# EAGLE board umotion_2_v1.2_pcb_2 (EAGLE 9.5.2)
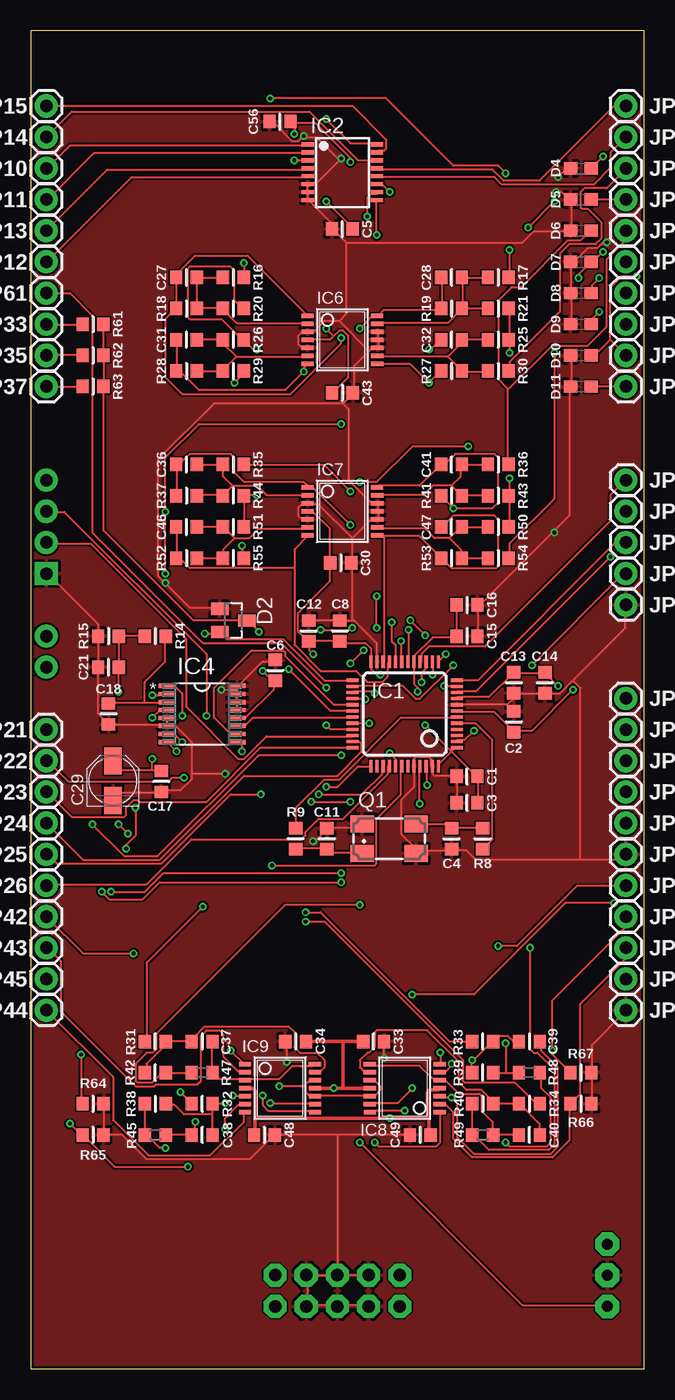
[diagram p5: board, top side]
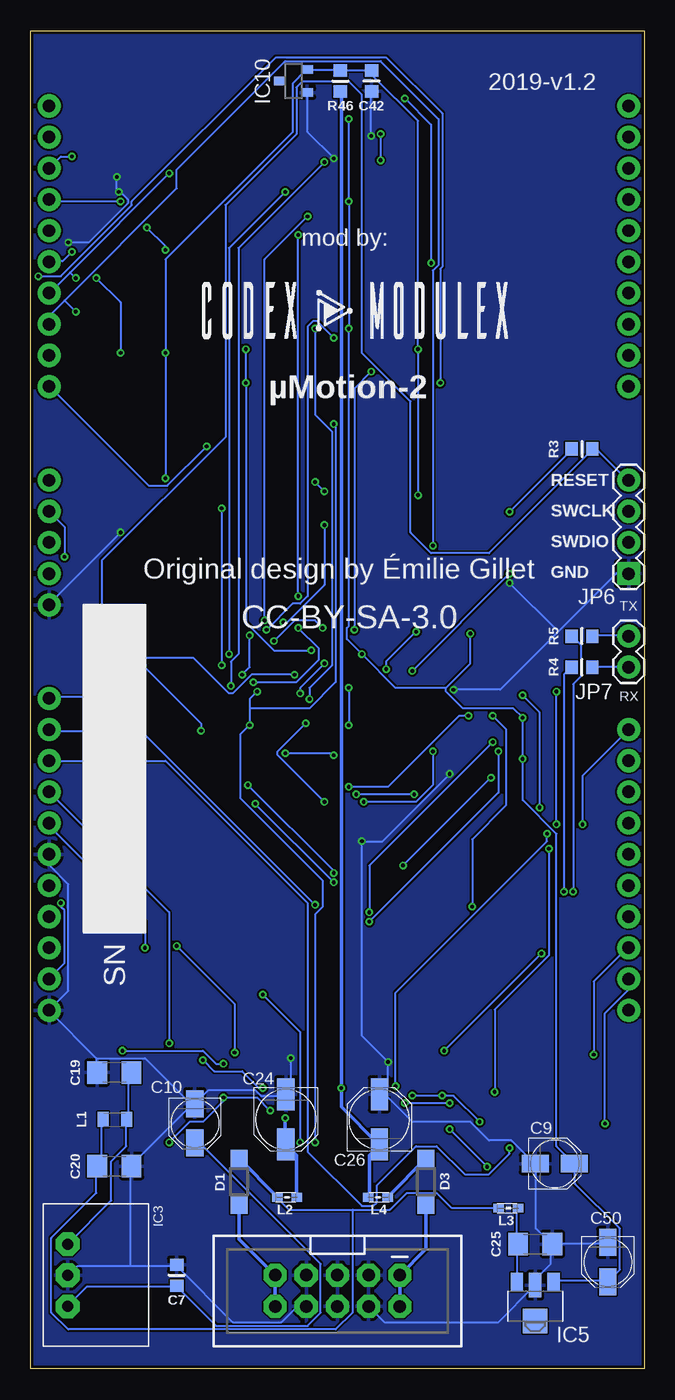
[diagram p6: board, bottom side, seen from below]

Size 50 x 109 mm. Coordinates in mm from the lower left corner, seen from the top.
Outline: 0,0 50,0 50,109 0,109 0,0
Copper layers (1*16): Top 0.035mm / dielectric 1.5mm / Bottom 0.035mm
Design rules "dirt_cheap_dirty_boards.v1.1": minimum track width 6mil, minimum drill 12mil, track to track 6mil, track to pad 6mil, pad to pad 6mil, via to via 6mil, smd to smd 0mil, copper to edge 10mil, drill to drill 10mil, minimum pad ring 10mil, minimum via ring 6mil, stop-mask expansion 2mil, vias tented up to drill 25mil, thermal gap 10mil

## Footprints (pad centres in the part's own frame; a part is rotated, then mirrored left to right if it is on the bottom)
PARTS_AMAN_RESISTOR_0603 = smd 1 x 1.1: 1 -0.85,0; 2 0.85,0
PANASONIC_B = smd 2.2 x 1.4: + 1.6,0; - -1.6,0
C1206 = smd 1.6 x 1.8: 1 -1.4,0; 2 1.4,0
PANASONIC_C = smd 2.6 x 1.4: + 2.05,0; - -2.05,0
SOD123 = smd 1.4 x 1.4: A 1.9,0; C -1.9,0
SOT23 = smd 1 x 1.4: 1 -0.95,-1.1; 2 0.95,-1.1; 3 0,1.1
0603 = smd 1.1 x 1: 1 -0.85,0; 2 0.85,0
LQFP48 = smd 0.254 x 1: 1 -2.75,-4.25; 2 -2.25,-4.25; 3 -1.75,-4.25; 4 -1.25,-4.25; 5 -0.75,-4.25; 6 -0.25,-4.25; 7 0.25,-4.25; 8 0.75,-4.25; 9 1.25,-4.25; 10 1.75,-4.25; 11 2.25,-4.25; 12 2.75,-4.25; 25 2.75,4.25; 26 2.25,4.25; 27 1.75,4.25; 28 1.25,4.25; 29 0.75,4.25; 30 0.25,4.25; 31 -0.25,4.25; 32 -0.75,4.25; 33 -1.25,4.25; 34 -1.75,4.25; 35 -2.25,4.25; 36 -2.75,4.25 | smd 1 x 0.254: 13 4.25,-2.75; 14 4.25,-2.25; 15 4.25,-1.75; 16 4.25,-1.25; 17 4.25,-0.75; 18 4.25,-0.25; 19 4.25,0.25; 20 4.25,0.75; 21 4.25,1.25; 22 4.25,1.75; 23 4.25,2.25; 24 4.25,2.75; 37 -4.25,2.75; 38 -4.25,2.25; 39 -4.25,1.75; 40 -4.25,1.25; 41 -4.25,0.75; 42 -4.25,0.25; 43 -4.25,-0.25; 44 -4.25,-0.75; 45 -4.25,-1.25; 46 -4.25,-1.75; 47 -4.25,-2.25; 48 -4.25,-2.75
TSSOP16_065 = smd 0.35 x 1: 1 -1.95,-2.825; 2 -1.3,-2.825; 3 -0.65,-2.825; 4 0,-2.825; 5 0.65,-2.825; 6 1.3,-2.825; 7 1.95,-2.825; 8 2.6,-2.825; 9 2.6,2.825; 10 1.95,2.825; 11 1.3,2.825; 12 0.65,2.825; 13 0,2.825; 14 -0.65,2.825; 15 -1.3,2.825; 16 -1.95,2.825
WE78 = drill 0.9 pad 1.93 octagon: 1 -2.54,0; 2 0,0; 3 2.54,0
SOP65P640X110-16N = smd 1.422 x 0.356: 1 -2.845,2.286; 2 -2.845,1.626; 3 -2.845,0.965; 4 -2.845,0.33; 5 -2.845,-0.33; 6 -2.845,-0.965; 7 -2.845,-1.626; 8 -2.845,-2.286; 9 2.845,-2.286; 10 2.845,-1.626; 11 2.845,-0.965; 12 2.845,-0.33; 13 2.845,0.33; 14 2.845,0.965; 15 2.845,1.626; 16 2.845,2.286
SOT89 = smd 1 x 1.5: 1 -1.499,-1.981; 3 1.499,-1.981 | smd 1 x 2: 2 0,-1.727 | smd 2 x 2: 2@1 0,1.194
TSSOP14_065 = smd 0.35 x 1: 1 -1.95,-2.845; 2 -1.3,-2.845; 3 -0.65,-2.845; 4 0,-2.845; 5 0.65,-2.845; 6 1.3,-2.845; 7 1.95,-2.845; 8 1.95,2.845; 9 1.3,2.845; 10 0.65,2.845; 11 0,2.845; 12 -0.65,2.845; 13 -1.3,2.845; 14 -1.95,2.825
DBZ_R-PDSO-G3 = smd 0.7 x 1: 1 -0.95,-1.1; 2 0.95,-1.1; 3 0,1.1
PARTS_AMAN_1X01 = drill 1.016 pad 1.88: 1 0,0
2X5-SHROUDED = drill 1.016 pad 1.88 octagon: 1 -1.27,5.08; 2 1.27,5.08; 3 -1.27,2.54; 4 1.27,2.54; 5 -1.27,0; 6 1.27,0; 7 -1.27,-2.54; 8 1.27,-2.54; 9 -1.27,-5.08; 10 1.27,-5.08
1X04 = drill 1.016 pad 1.88 square: 1 0,0 | drill 1.016 pad 1.88: 2 2.54,0; 3 5.08,0; 4 7.62,0
1X02 = drill 1.016 pad 1.88: 1 0,0; 2 2.54,0
L2012C = smd 0.9 x 1.25: 1 -0.9,0; 2 1,0
0603' = smd 0.85 x 0.7: 1 -0.9,0; 2 0.7,0
CTS406 = smd 1.9 x 1.4: 1 -2.2,-1.2; 2 2.2,-1.2; 3 2.2,1.2; 4 -2.2,1.2
R0603 = smd 1 x 1.1: 1 -0.85,0; 2 0.85,0

## Placement (x,y rotation side)
C1  1u  [PARTS_AMAN_RESISTOR_0603]  35.56,48.26 180 top
C2  100n  [PARTS_AMAN_RESISTOR_0603]  39.37,52.7 90 top
C3  100n  [PARTS_AMAN_RESISTOR_0603]  35.56,46.1 180 top
C4  20p  [PARTS_AMAN_RESISTOR_0603]  34.29,43.18 90 top
C5  100n  [PARTS_AMAN_RESISTOR_0603]  25.4,92.84 180 top
C6  100n  [PARTS_AMAN_RESISTOR_0603]  19.94,56.9 90 top
C7  100n  [PARTS_AMAN_RESISTOR_0603]  38.1,7.62 90 bottom
C8  100n  [PARTS_AMAN_RESISTOR_0603]  25.2,60.11 90 top
C9  10u  [PANASONIC_B]  7.29,16.71 0 bottom
C10  10u  [PANASONIC_B]  36.63,19.99 270 bottom
C11  20p  [PARTS_AMAN_RESISTOR_0603]  24.13,43.18 270 top
C12  1u  [PARTS_AMAN_RESISTOR_0603]  22.66,60.11 90 top
C13  1u  [PARTS_AMAN_RESISTOR_0603]  39.37,55.88 270 top
C14  100n  [PARTS_AMAN_RESISTOR_0603]  41.91,55.88 270 top
C15  100n  [PARTS_AMAN_RESISTOR_0603]  35.56,59.69 0 top
C16  1u  [PARTS_AMAN_RESISTOR_0603]  35.56,62.23 0 top
C17  100n  [PARTS_AMAN_RESISTOR_0603]  10.64,47.84 270 top
C18  1u  [PARTS_AMAN_RESISTOR_0603]  6.35,53.34 270 top
C19  22u  [C1206]  43.18,24.13 180 bottom
C20  22u  [C1206]  43.18,16.51 0 bottom
C21  1u  [PARTS_AMAN_RESISTOR_0603]  6.35,57.15 180 top
C24  22u  [PANASONIC_C]  29.21,20.32 270 bottom
C25  22u  [C1206]  8.89,10.16 0 bottom
C26  22u  [PANASONIC_C]  21.59,20.32 90 bottom
C27  100p  [PARTS_AMAN_RESISTOR_0603]  12.7,88.9 180 top
C28  1.0n  [PARTS_AMAN_RESISTOR_0603]  34.29,88.9 180 top
C29  10u  [PANASONIC_B]  6.71,47.9 90 top
C30  100n  [PARTS_AMAN_RESISTOR_0603]  25.27,65.66 0 top
C31  100p  [PARTS_AMAN_RESISTOR_0603]  12.7,83.82 180 top
C32  1.0n  [PARTS_AMAN_RESISTOR_0603]  34.29,83.82 180 top
C33  100n  [PARTS_AMAN_RESISTOR_0603]  27.94,26.67 180 top
C34  100n  [PARTS_AMAN_RESISTOR_0603]  21.59,26.67 0 top
C36  100p  [PARTS_AMAN_RESISTOR_0603]  12.7,73.66 180 top
C37  47p  [PARTS_AMAN_RESISTOR_0603]  13.97,26.67 0 top
C38  47p  [PARTS_AMAN_RESISTOR_0603]  13.97,19.05 180 top
C39  47p  [PARTS_AMAN_RESISTOR_0603]  40.64,26.67 0 top
C40  47p  [PARTS_AMAN_RESISTOR_0603]  40.64,19.05 180 top
C41  1.0n  [PARTS_AMAN_RESISTOR_0603]  34.29,73.66 180 top
C42  1u  [PARTS_AMAN_RESISTOR_0603]  22.23,104.9 270 bottom
C43  100n  [PARTS_AMAN_RESISTOR_0603]  25.4,79.5 0 top
C46  1.0n  [PARTS_AMAN_RESISTOR_0603]  12.7,68.58 180 top
C47  1.0n  [PARTS_AMAN_RESISTOR_0603]  34.29,68.58 180 top
C48  100n  [PARTS_AMAN_RESISTOR_0603]  19.05,19.05 0 top
C49  100n  [PARTS_AMAN_RESISTOR_0603]  31.75,19.05 180 top
C50  10u  [PANASONIC_B]  2.97,8.69 270 bottom
C56  1.0n  [PARTS_AMAN_RESISTOR_0603]  20.32,101.6 180 top
D1  1N5819HW  [SOD123]  33.02,15.24 270 bottom
D2  BAT54S  [SOT23]  16.51,60.96 270 top
D3  1N5819HW  [SOD123]  17.78,15.24 90 bottom
D4  TVS  [0603]  44.83,97.79 0 top
D5  TVS  [0603]  44.83,95.25 0 top
D6  TVS  [0603]  44.83,92.71 0 top
D7  TVS  [0603]  44.83,90.17 0 top
D8  TVS  [0603]  44.83,87.63 0 top
D9  TVS  [0603]  44.83,85.09 0 top
D10  TVS  [0603]  44.83,82.55 0 top
D11  TVS  [0603]  44.83,80.01 0 top
IC1  STM32F373CCT6  [LQFP48]  30.48,53.34 90 top
IC2  4051PW  [TSSOP16_065]  25.4,97.79 270 top
IC3  R-78E3.3-0.5  [WE78]  46.99,7.62 270 bottom
IC4  DAC8164ICPW  [SOP65P640X110-16N]  13.97,53.34 0 top
IC5  LD2981ABU33  [SOT89]  8.89,5.08 180 bottom
IC6  MCP6004  [TSSOP14_065]  25.4,83.82 270 top
IC7  MCP6004  [TSSOP14_065]  25.4,69.85 270 top
IC8  TLV4172  [TSSOP14_065]  30.48,22.86 90 top
IC9  TLV4172  [TSSOP14_065]  20.32,22.86 270 top
IC10  LM4040B10  [DBZ_R-PDSO-G3]  28.57,104.9 90 bottom
JP1  +3V3_A  [PARTS_AMAN_1X01]  48.5,54.61 0 top
JP5  M05X2SHD  [2X5-SHROUDED]  25,6.35 270 bottom
JP6  [1X04]  1.27,64.77 90 bottom
JP7  [1X02]  1.27,57.15 90 bottom
JP8  SLOPE_POT  [PARTS_AMAN_1X01]  48.5,100.33 0 top
JP9  SMOOTHNESS_POT  [PARTS_AMAN_1X01]  48.5,102.87 0 top
JP10  SLOPE_ATT  [PARTS_AMAN_1X01]  1.27,97.79 0 top
JP11  FREQUENCY_ATT  [PARTS_AMAN_1X01]  1.27,95.25 0 top
JP12  SMOOTHNESS_ATT  [PARTS_AMAN_1X01]  1.27,90.17 0 top
JP13  SHAPE_ATT  [PARTS_AMAN_1X01]  1.27,92.71 0 top
JP14  SHIFT_POT  [PARTS_AMAN_1X01]  1.27,100.33 0 top
JP15  SHIFT_ATT  [PARTS_AMAN_1X01]  1.27,102.87 0 top
JP16  FREQUENCY_POT  [PARTS_AMAN_1X01]  48.5,72.39 0 top
JP17  SHAPE_POT  [PARTS_AMAN_1X01]  48.5,69.85 0 top
JP21  LED_1_R  [PARTS_AMAN_1X01]  1.27,52.07 0 top
JP22  LED_1_G  [PARTS_AMAN_1X01]  1.27,49.53 0 top
JP23  LED_3_R  [PARTS_AMAN_1X01]  1.27,46.99 0 top
JP24  LED_3_G  [PARTS_AMAN_1X01]  1.27,44.45 0 top
JP25  LED_2_R  [PARTS_AMAN_1X01]  1.27,41.91 0 top
JP26  LED_2_G  [PARTS_AMAN_1X01]  1.27,39.37 0 top
JP27  J5  [PARTS_AMAN_1X01]  48.5,97.79 0 top
JP28  J4  [PARTS_AMAN_1X01]  48.5,92.71 0 top
JP29  J3  [PARTS_AMAN_1X01]  48.5,90.17 0 top
JP30  J6  [PARTS_AMAN_1X01]  48.5,95.25 0 top
JP31  J1  [PARTS_AMAN_1X01]  48.5,87.63 0 top
JP32  J2_TIP_1  [PARTS_AMAN_1X01]  48.5,85.09 0 top
JP33  J2_TIP_2  [PARTS_AMAN_1X01]  1.27,85.09 0 top
JP34  J7_TIP_1  [PARTS_AMAN_1X01]  48.5,82.55 0 top
JP35  J7_TIP_2  [PARTS_AMAN_1X01]  1.27,82.55 0 top
JP36  J8_TIP_1  [PARTS_AMAN_1X01]  48.5,80.01 0 top
JP37  J8_TIP_2  [PARTS_AMAN_1X01]  1.27,80.01 0 top
JP38  J9  [PARTS_AMAN_1X01]  48.5,52.07 0 top
JP39  J10  [PARTS_AMAN_1X01]  48.5,49.53 0 top
JP40  J11  [PARTS_AMAN_1X01]  48.5,46.99 0 top
JP41  J12  [PARTS_AMAN_1X01]  48.5,44.45 0 top
JP42  LED4_1  [PARTS_AMAN_1X01]  1.27,36.83 0 top
JP43  LED4_2  [PARTS_AMAN_1X01]  1.27,34.29 0 top
JP44  LED5_1  [PARTS_AMAN_1X01]  1.27,29.21 0 top
JP45  LED5_2  [PARTS_AMAN_1X01]  1.27,31.75 0 top
JP46  LED6_1  [PARTS_AMAN_1X01]  48.5,31.75 0 top
JP47  LED6_2  [PARTS_AMAN_1X01]  48.5,34.29 0 top
JP48  LED7_1  [PARTS_AMAN_1X01]  48.5,39.37 0 top
JP49  LED7_2  [PARTS_AMAN_1X01]  48.5,36.83 0 top
JP50  GND  [PARTS_AMAN_1X01]  48.5,29.21 0 top
JP51  GND  [PARTS_AMAN_1X01]  48.5,41.91 0 top
JP52  GND  [PARTS_AMAN_1X01]  48.5,62.23 0 top
JP60  SW_2_SW_RANGE  [PARTS_AMAN_1X01]  48.5,67.31 0 top
JP61  SW_3_SW_MODE  [PARTS_AMAN_1X01]  1.27,87.63 0 top
JP62  SW_1_SW_SHIFT  [PARTS_AMAN_1X01]  48.5,64.77 0 top
L1  33u  [L2012C]  43.18,20.32 0 bottom
L2  [0603']  29.21,13.97 180 bottom
L3  [0603']  11.18,13.08 180 bottom
L4  [0603']  21.59,13.97 0 bottom
Q1  8MHz  [CTS406]  29.21,43.18 0 top
R3  10k  [PARTS_AMAN_RESISTOR_0603]  5.08,74.93 0 bottom
R4  100  [PARTS_AMAN_RESISTOR_0603]  5.08,57.15 180 bottom
R5  100  [PARTS_AMAN_RESISTOR_0603]  5.08,59.69 180 bottom
R8  100  [PARTS_AMAN_RESISTOR_0603]  36.83,43.18 90 top
R9  100  [PARTS_AMAN_RESISTOR_0603]  21.59,43.18 270 top
R14  130k  [PARTS_AMAN_RESISTOR_0603]  10.16,59.69 0 top
R15  100k  [PARTS_AMAN_RESISTOR_0603]  6.35,59.69 0 top
R16  100k  [PARTS_AMAN_RESISTOR_0603]  16.51,88.9 0 top
R17  100k  [PARTS_AMAN_RESISTOR_0603]  38.1,88.9 0 top
R18  20k  [PARTS_AMAN_RESISTOR_0603]  12.7,86.36 0 top
R19  20k  [PARTS_AMAN_RESISTOR_0603]  34.29,86.36 0 top
R20  120k  [PARTS_AMAN_RESISTOR_0603]  16.51,86.36 0 top
R21  120k  [PARTS_AMAN_RESISTOR_0603]  38.1,86.36 0 top
R25  120k  [PARTS_AMAN_RESISTOR_0603]  38.1,83.82 0 top
R26  390k  [PARTS_AMAN_RESISTOR_0603]  16.51,83.82 0 top
R27  20k  [PARTS_AMAN_RESISTOR_0603]  34.29,81.28 0 top
R28  130k  [PARTS_AMAN_RESISTOR_0603]  12.7,81.28 0 top
R29  100k  [PARTS_AMAN_RESISTOR_0603]  16.51,81.28 0 top
R30  100k  [PARTS_AMAN_RESISTOR_0603]  38.1,81.28 0 top
R31  20k  [PARTS_AMAN_RESISTOR_0603]  10.16,26.67 180 top
R32  20k  [PARTS_AMAN_RESISTOR_0603]  13.97,21.59 180 top
R33  20k  [PARTS_AMAN_RESISTOR_0603]  36.83,26.67 180 top
R34  20k  [PARTS_AMAN_RESISTOR_0603]  40.64,21.59 0 top
R35  100k  [PARTS_AMAN_RESISTOR_0603]  16.51,73.66 0 top
R36  100k  [PARTS_AMAN_RESISTOR_0603]  38.1,73.66 0 top
R37  130k  [PARTS_AMAN_RESISTOR_0603]  12.7,71.12 0 top
R38  130k  [PARTS_AMAN_RESISTOR_0603]  10.16,21.59 0 top
R39  130k  [PARTS_AMAN_RESISTOR_0603]  36.83,24.13 180 top
R40  130k  [PARTS_AMAN_RESISTOR_0603]  36.83,21.59 0 top
R41  20k  [PARTS_AMAN_RESISTOR_0603]  34.29,71.12 0 top
R42  130k  [PARTS_AMAN_RESISTOR_0603]  10.16,24.13 180 top
R43  120k  [PARTS_AMAN_RESISTOR_0603]  38.1,71.12 0 top
R44  390k  [PARTS_AMAN_RESISTOR_0603]  16.51,71.12 0 top
R45  1.0k  [R0603]  10.16,19.05 0 top
R46  1.5k  [PARTS_AMAN_RESISTOR_0603]  24.77,104.9 90 bottom
R47  1.0k  [R0603]  13.97,24.13 0 top
R48  1.0k  [R0603]  40.64,24.13 0 top
R49  1.0k  [R0603]  36.83,19.05 0 top
R50  140k  [PARTS_AMAN_RESISTOR_0603]  38.1,68.58 0 top
R51  120k  [PARTS_AMAN_RESISTOR_0603]  16.51,68.58 0 top
R52  20k  [PARTS_AMAN_RESISTOR_0603]  12.7,66.04 0 top
R53  33k  [PARTS_AMAN_RESISTOR_0603]  34.29,66.04 0 top
R54  100k  [PARTS_AMAN_RESISTOR_0603]  38.1,66.04 0 top
R55  100k  [PARTS_AMAN_RESISTOR_0603]  16.51,66.04 0 top
R61  10k  [PARTS_AMAN_RESISTOR_0603]  5.08,85.09 0 top
R62  10k  [PARTS_AMAN_RESISTOR_0603]  5.08,82.55 0 top
R63  10k  [PARTS_AMAN_RESISTOR_0603]  5.08,80.01 0 top
R64  1.0k  [PARTS_AMAN_RESISTOR_0603]  5.08,21.59 0 top
R65  1.0k  [PARTS_AMAN_RESISTOR_0603]  5.08,19.05 0 top
R66  1.0k  [PARTS_AMAN_RESISTOR_0603]  44.83,21.59 0 top
R67  1.0k  [PARTS_AMAN_RESISTOR_0603]  44.83,24.13 0 top

## Tracks (layer width: path | path; a pad name or v marks a point on that pad's centre or on a via)
+3V3  (via drill 0.3)
  Top 0.152: C3.1 36.42,46.18 36.42,48.16 C1.1 36.27,48.31 34.29,50.29 | 34.29,50.29 34.59,50.6 IC1.1 | 34.29,50.29 33.22,49.23 IC1.48 | C16.1 34.75,62.18 34.75,59.74 C15.1 34.59,59.59 32.77,59.59 31.24,58.06 31.24,57.61 IC1.17 31.24,57.45 31.24,55.78 31.55,55.47 v31.55,55.17 | v32.16,52.43 34.29,50.29 | 19.81,55.93 19.81,55.32 17.53,53.03 16.92,53.03 IC4.12 | v10.97,64.77 v10.97,69.8 10.97,74.22 13.72,76.96 v25.3,76.96 | 19.81,55.93 v18.9,56.84 | 19.81,55.93 C6.1 | v26.82,18.44 40.08,5.18 46.94,5.18 IC3.3
  Bottom 0.152: 38.1,6.71 45.41,6.71 46.94,5.18 IC3.3 | 38.1,6.71 34.9,3.5 27.43,3.5 26.36,4.57 26.36,8.53 36.12,18.29 36.58,18.29 C10.+ | 38.1,6.71 C7.1 | 32.16,53.8 32.16,54.56 v31.55,55.17 | 32.16,53.8 v32.16,52.43 32.92,51.66 32.92,46.48 26.21,39.78 26.21,37.64 26.82,37.03 v26.82,18.44 | v10.97,69.8 5.94,74.83 R3.1 | v18.9,56.84 v10.97,64.77 | 32.16,53.8 27.28,53.8 25.15,55.93 25.15,76.81 v25.3,76.96
+3V3_A  (via drill 0.3)
  Top 0.152: IC6.4 24.38,83.82 24.69,84.12 | 24.69,84.12 25.15,84.58 25.45,84.58 25.91,84.12 25.91,80.77 24.69,79.55 C43.1 | v24.08,101.8 26.06,99.82 28.19,99.82 IC2.16 | v24.08,95.1 26.21,92.96 C5.1 | v24.08,84.73 24.69,84.12 | IC1.9 34.75,54.71 37.34,54.71 39.32,56.69 C13.1 39.47,56.69 41.91,56.69 | 41.91,56.69 v42.98,55.63 | 41.91,56.69 C14.1 | IC7.4 22.55,69.8 23.01,69.8 24.38,68.43 24.38,65.68 C30.1 24.38,65.53 24.38,64.16 21.79,61.57 21.79,60.05 22.55,59.28 C12.1 | C12.1 22.71,59.28 25.15,59.28 C8.1 25.3,59.13 27.28,59.13 27.74,58.67 27.74,57.61 IC1.24 27.74,57.45 27.74,57 28.19,56.54 v28.5,56.54 | IC1.25 26.21,56.08 23.93,56.08 20.57,59.44 16,59.44 15.54,59.89 D2.2 15.39,59.89 v14.17,59.89 | 9.91,48.77 7.32,48.77 6.71,49.38 C29.+ | 9.91,48.77 10.52,48.77 C17.1 | v9.91,53.03 10.52,53.65 11.12,53.65 IC4.4 | 9.91,48.77 v9.91,49.68 | v23.01,58.22 22.71,58.52 22.71,59.13 C12.1
  Bottom 0.152: v24.08,101.8 v24.08,95.1 v24.08,84.73 24.08,60.5 24.23,60.35 24.23,59.44 v23.01,58.22 20.27,55.47 16.15,55.47 | JP1.1 48.46,54.71 43.89,54.71 v42.98,55.63 42.98,55.93 41,57.91 36.73,57.91 33.83,55.02 33.53,55.02 32,56.54 v28.5,56.54 | IC5.1 7.32,7.16 3.05,7.16 C50.+ 2.9,7.16 1.98,8.08 1.98,11.43 5.64,15.09 5.64,16.61 C9.+ 5.79,16.76 7.16,18.14 7.16,43.59 9.91,46.33 v9.91,49.68 v9.91,53.03 10.67,53.8 14.78,53.8 16.15,55.17 16.15,55.47 | v14.17,59.89 14.17,57.45 16.15,55.47
ADC_CLOCK  (via drill 0.3)
  Top 0.152: R37.1 11.89,71.17 11.89,73.61 C36.2 11.89,73.76 12.19,73.76 12.95,74.52 16.31,74.52 16.61,74.22 16.61,73 17.37,72.24 22.25,72.24 22.55,71.93 IC7.1 22.55,71.78 23.01,71.78 v26.06,68.73 | v29.41,60.81 29.41,59.28 29.72,58.98 29.72,57.61 IC1.20
  Bottom 0.152: v29.41,60.81 29.11,60.81 26.06,63.86 v26.06,68.73
ADC_FM
  Top 0.152: C46.2 11.89,68.58 11.89,66.14 R52.1 11.89,65.99 12.19,65.99 12.95,65.23 21.49,65.23 | 21.49,65.23 21.49,66.75 22.55,67.82 IC7.7 | 21.49,65.23 21.49,58.98 23.62,56.84 26.52,56.84 27.43,55.93 28.65,55.93 29.11,56.39 29.11,57.45 IC1.21
ADC_SHAPE  (via drill 0.3)
  Top 0.152: v28.04,55.02 27.89,55.17 26.36,55.17 IC1.27 | v27.13,58.52 v26.06,57.45 | R27.1 33.38,81.23 v32.46,80.31 30.94,81.84 28.35,81.84 IC6.8 | v32.46,83.06 32.61,83.06 33.38,83.82 C32.2
  Bottom 0.152: v28.04,55.02 28.04,55.47 v26.06,57.45 | v27.13,58.52 30.18,58.52 32.46,60.81 v32.46,80.31 v32.46,83.06
ADC_SHIFT  (via drill 0.3)
  Top 0.152: C28.2 33.53,88.85 33.53,86.41 R19.1 33.38,86.26 28.8,86.26 28.35,85.8 IC6.14 28.19,85.65 27.74,85.65 v26.82,84.73 | v27.28,54.56 26.36,54.56 IC1.28
  Bottom 0.152: v27.28,54.56 27.28,55.47 25.45,57.3 25.45,76.35 26.82,77.72 v26.82,84.73
ADC_SLOPE  (via drill 0.3)
  Top 0.152: IC6.1 22.55,85.8 17.68,90.68 13.41,90.68 11.73,89 C27.2 11.89,88.85 11.89,86.41 R18.1 11.73,86.26 10.97,85.5 10.97,80.77 12.34,79.4 21.18,79.4 25.3,83.52 v25.3,83.97 | v30.79,60.2 30.79,57.61 IC1.18
  Bottom 0.152: v30.79,60.2 28.65,62.33 28.04,62.33 27.43,62.94 27.43,84.89 26.98,85.34 26.67,85.34 v25.3,83.97
ADC_SMOOTHNESS  (via drill 0.3)
  Top 0.152: IC7.14 28.35,71.93 31.7,71.93 33.38,73.61 C41.2 33.53,73.76 33.83,73.76 34.59,74.52 37.8,74.52 38.1,74.22 38.1,70.56 37.64,70.1 v34.44,70.1 33.53,71.02 R41.1 | v34.44,57.3 31.7,54.56 31.39,54.56 30.33,55.63 26.36,55.63 IC1.26
  Bottom 0.152: v34.44,70.1 v34.44,57.3
ADC_TRIG  (via drill 0.3)
  Top 0.152: C31.2 11.89,83.82 11.89,81.38 R28.1 11.89,81.23 12.19,81.23 13.72,79.7 20.73,79.7 v22.25,81.23 22.25,81.53 22.55,81.84 IC6.7 | v30.18,59.28 30.18,57.61 IC1.19 | v26.21,60.35 26.06,60.35 25.91,60.2 v23.62,60.2
  Bottom 0.152: v30.18,59.28 28.5,60.96 26.82,60.96 v26.21,60.35 | v23.62,60.2 23.62,79.86 v22.25,81.23
ADC_V_OCT
  Top 0.152: 28.8,67.82 31.7,67.82 33.38,66.14 R53.1 33.53,65.99 34.29,65.23 37.95,65.23 38.1,65.38 38.1,69.19 37.8,69.49 34.44,69.49 33.53,68.58 C47.2 | 28.8,67.82 28.35,67.82 IC7.8 | 28.8,67.82 28.8,57.61 IC1.22
AREF_-10  (via drill 0.3)
  Top 0.152: R50.2 39.01,68.58 39.01,71.02 R43.2 39.01,71.17 v39.01,72.54 | 39.01,83.82 39.01,86.26 R21.2 | 39.01,83.82 v39.01,82.75 | 39.01,83.82 R25.2 | R51.2 17.37,68.58 17.37,71.02 R44.2 17.37,71.17 v18.44,71.17 | R20.2 17.22,86.41 16.61,87.02 16.61,89.46 16.31,89.76 12.95,89.76 12.8,89.61 12.8,85.65 12.95,85.5 15.54,85.5 17.22,83.82 R26.2 17.37,83.82 18.14,83.06 v18.44,83.06
  Bottom 0.152: v39.01,72.54 v39.01,82.75 39.01,90.37 28.65,100.74 28.65,104.7 27.58,105.77 IC10.2 27.43,105.77 24.84,105.77 R46.2 24.69,105.77 22.25,105.77 C42.1 22.1,105.61 22.1,105.31 18.44,101.65 v18.44,83.06 v18.44,71.17
CLOCK_IN  (via drill 0.3)
  Top 0.152: v26.06,71.48 23.93,73.61 17.37,73.61 R35.2 | v26.82,72.24 28.19,72.24 31.09,75.13 v35.66,75.13 | JP36.1 D11.2
  Bottom 0.152: v26.82,72.24 v26.06,71.48 | v35.66,75.13 38.86,71.93 40.39,71.93 48.46,80.01 JP36.1
DAC_1  (via drill 0.3)
  Top 0.152: v14.02,37.64 9.45,33.07 9.45,26.67 R31.2 | v12.34,53.19 12.34,55.02 11.73,55.63 IC4.1
  Bottom 0.152: v14.02,37.64 14.02,43.13 11.28,45.87 11.28,52.12 v12.34,53.19
DAC_2  (via drill 0.3)
  Top 0.152: v12.19,22.55 13.11,21.64 R32.2 | v7.77,42.37 7.77,42.67 8.53,43.43 v8.53,45.72 | v9.91,54.86 11.12,54.86 IC4.2
  Bottom 0.152: v12.19,22.55 12.19,29.26 7.77,33.68 v7.77,42.37 | v8.53,45.72 8.53,53.49 v9.91,54.86
DAC_3  (via drill 0.3)
  Top 0.152: R33.2 34.14,26.67 23.62,37.19 v22.4,37.19 | v12.34,51.05 11.73,51.66 11.12,51.66 IC4.7
  Bottom 0.152: v22.4,37.19 22.4,41 v12.34,51.05
DAC_4  (via drill 0.3)
  Top 0.152: v22.4,36.42 23.93,36.42 35.2,25.15 35.2,23.47 35.36,23.32 39.47,23.32 41.15,21.64 41.45,21.64 R34.2 | IC4.8 v11.89,50.29
  Bottom 0.152: v22.4,36.42 11.89,46.94 v11.89,50.29
DAC_MOSI
  Top 0.152: IC1.31 26.21,53.03 18.14,53.03 17.53,52.43 16.92,52.43 IC4.11
DAC_SCK
  Top 0.152: IC1.29 26.21,54.1 24.69,54.1 20.73,58.06 20.73,58.37 20.57,58.52 17.98,58.52 14.94,55.47 14.94,53.03 16.15,51.82 16.76,51.82 IC4.10
DAC_SS  (via drill 0.3)
  Top 0.152: v27.58,52.58 26.36,52.58 IC1.32 | v22.86,46.18 v26.06,46.18 | v17.22,50.29 17.22,50.75 16.92,51.05 IC4.9
  Bottom 0.152: v27.58,52.58 29.87,50.29 29.87,49.99 v26.06,46.18 | v22.86,46.18 18.59,46.18 17.22,47.55 v17.22,50.29
FM_IN  (via drill 0.3)
  Top 0.152: v17.22,67.06 17.22,66.14 R55.2 | v46.33,86.11 45.72,85.5 45.72,85.19 D9.2
  Bottom 0.152: v17.22,67.06 17.22,89.46 16.76,89.92 16.76,101.8 21.49,106.53 29.26,106.53 38.1,97.69 38.1,96.16 47.24,87.02 | 47.24,87.02 48.46,85.8 48.46,85.19 JP32.1 | 47.24,87.02 v46.33,86.11
FREQUENCY_ATT
  Top 0.152: IC2.2 22.55,99.06 5.18,99.06 1.37,95.25 JP11.1
FREQUENCY_POT
  Top 0.152: IC1.16 31.85,57.61 31.85,58.22 32.46,58.83 37.03,58.83 47.24,69.04 47.24,71.17 48.46,72.39 JP16.1
GND  (via drill 0.3)
  Top 0.152: 44.04,87.63 44.04,85.19 D9.1 | 44.04,87.63 44.04,90.07 D7.1 44.04,90.22 44.35,90.22 45.41,91.29 46.18,91.29 46.63,91.75 v46.94,91.75 | 44.04,87.63 D8.1 | v42.98,97.08 43.59,97.69 43.89,97.69 D4.1 | v42.82,95.86 43.28,95.86 43.89,95.25 D5.1 44.04,95.25 44.04,92.81 D6.1 43.89,92.66 41,92.66 40.08,91.75 25.76,91.75 | 25.15,98.45 23.32,96.62 22.71,96.62 IC2.6 22.55,96.47 22.55,95.86 IC2.7 22.55,95.71 22.55,95.25 IC2.8 22.71,95.1 24.54,93.27 24.54,92.96 C5.2 24.69,92.81 25.76,91.75 | 22.25,100.28 23.32,100.28 25.15,98.45 | 22.25,100.28 22.1,100.28 21.79,99.97 21.34,99.97 19.81,101.5 19.51,101.5 C56.2 | 25.15,98.45 v25.3,98.6 | 22.25,100.28 v22.25,100.43 | C29.- 6.71,46.33 7.32,46.94 10.52,46.94 C17.2 10.67,47.09 12.19,47.09 13.11,48.01 13.11,48.46 | 5.49,57.15 5.49,59.59 R15.1 5.49,59.74 5.49,60.66 1.37,64.77 JP6.1 | 11.12,52.43 6.4,52.43 C18.2 6.25,52.58 5.49,53.34 5.49,57.15 | 11.12,52.43 IC4.5 | 11.12,52.43 IC4.6 11.12,52.27 11.89,52.27 13.11,51.05 13.11,48.46 | 5.49,57.15 C21.2 | IC4.13 16.76,53.8 16.76,54.25 IC4.14 16.76,54.41 16.76,54.86 IC4.15 16.76,55.02 16.76,55.32 | C6.2 19.81,57.61 18.9,57.61 16.92,55.63 IC4.16 16.76,55.63 16.76,55.32 | v15.54,55.32 16.76,55.32 | 22.55,70.41 22.1,70.41 21.79,70.1 21.79,69.49 21.95,69.34 22.55,69.34 IC7.5 | 26.21,60.96 C8.2 C12.2 | 26.21,60.96 26.36,60.96 28.19,59.13 28.19,57.61 IC1.23 | 26.21,60.96 26.21,65.53 C30.2 26.21,65.68 26.21,67.67 | 26.21,67.67 27.74,69.19 28.19,69.19 IC7.10 28.35,69.34 28.35,69.8 IC7.11 28.35,69.95 28.35,70.41 IC7.12 28.19,70.56 27.74,70.56 25.91,72.39 25.91,78.18 25.45,78.64 | 22.55,70.41 23.47,70.41 26.21,67.67
  Top 0.152: 22.55,70.41 IC7.3 | IC6.5 22.55,83.21 22.1,83.21 21.79,83.52 21.79,84.12 22.1,84.43 22.55,84.43 IC6.3 22.55,84.58 23.16,84.58 23.93,85.34 25.15,85.34 | 28.35,83.82 28.35,83.21 IC6.10 28.19,83.06 27.74,83.06 27.58,82.91 | 28.35,83.82 28.35,84.43 IC6.12 | 28.35,83.82 IC6.11 | 27.58,82.91 26.36,81.69 26.36,79.55 C43.2 26.21,79.4 25.45,78.64 | 25.45,78.64 14.94,78.64 10.36,74.07 10.36,64.62 v10.97,64.01 12.95,62.03 15.39,62.03 D2.1 | 27.58,82.91 25.15,85.34 | 25.76,91.75 25.76,85.95 25.15,85.34 | Q1.4 26.98,44.35 26.67,44.04 24.23,44.04 C11.1 24.08,43.89 23.16,42.98 v23.01,42.98 | v20.88,24.99 20.88,26.67 C34.1 | JP5.7 JP5.5 | 22.55,7.62 22.55,5.18 | JP5.8 27.43,5.18 25.15,5.18 JP5.6 24.99,5.18 22.55,5.18 | 22.55,5.18 JP5.4 | 22.55,7.62 JP5.5 | 22.55,7.62 JP5.3 | 5.94,19.05 5.94,21.49 R64.2 | C49.2 24.99,19.05 | 24.99,19.05 C48.2 19.81,19.05 17.83,17.07 9.45,17.07 7.47,19.05 5.94,19.05 | 5.94,19.05 R65.2 | 24.99,19.05 JP5.5 | v28.8,25.3 28.8,26.67 C33.1 | C15.2 36.42,59.74 36.42,62.18 C16.2 36.42,62.33 36.73,62.33 42.52,68.12 | D10.1 44.04,82.45 44.04,80.01 D11.1 43.89,80.01 43.89,69.49 42.52,68.12 | 38.86,54.1 34.75,54.1 IC1.8 | 38.86,54.1 39.32,53.65 C2.2 | 38.86,54.1 39.32,54.56 39.32,55.02 C13.2 39.47,55.02 41.91,55.02 | 44.2,56.08 43.13,55.02 41.91,55.02 | 44.2,56.08 48.46,60.35 48.46,62.18 JP52.1 | 41.91,55.02 C14.2 | 34.29,42.22 31.7,42.22 31.55,42.06 Q1.2 31.39,42.06 31.39,42.37 30.18,43.59 30.18,46.33 31.24,47.4 31.24,49.07 IC1.44 31.24,49.23 31.24,49.68 31.39,49.84 32.46,49.84 32.61,49.68 32.61,49.23 IC1.47 32.77,49.07 32.77,48.46 32.92,48.31 34.59,48.31 C1.2 34.75,48.16 34.75,46.18 C3.2
  Top 0.152: R66.2 45.72,21.64 45.72,24.08 R67.2 45.72,24.23 45.72,26.36 48.46,29.11 JP50.1 | 34.29,42.22 35.51,42.22 36.27,41.45 44.81,41.45 | 44.81,41.45 48.01,41.45 48.46,41.91 JP51.1 | 34.29,42.22 C4.1 | 44.2,56.08 44.81,55.47 44.81,41.45 | v42.67,68.12 42.52,68.12 | v15.85,48.46 13.11,48.46
  Bottom 0.152: v42.98,97.08 42.98,96.01 v42.82,95.86 42.67,95.86 42.06,95.25 42.06,94.94 45.26,91.75 v46.94,91.75 | v25.3,98.6 27.43,100.74 27.43,103.94 IC10.1 | v22.25,100.43 22.25,103.94 C42.2 | v15.54,55.32 11.73,55.32 7.01,60.05 | 7.01,60.05 2.29,64.77 JP6.1 | v10.97,64.01 7.01,60.05 | 21.34,22.55 21.49,22.4 C26.+ 21.34,22.55 | 21.34,22.55 20.88,23.01 v20.88,24.99 23.01,27.13 v23.01,42.98 21.34,42.98 v15.85,48.46 | C25.2 7.62,10.06 7.62,8.53 8.84,7.32 8.84,6.86 IC5.2 8.99,6.71 11.89,3.81 21.18,3.81 22.4,5.03 JP5.4 | C50.- 3.05,10.21 7.47,10.21 C25.2 | C25.2 7.62,10.21 8.84,11.43 8.84,16.61 C9.- 8.99,16.76 10.82,18.59 12.65,18.59 14.17,20.12 18.9,20.12 21.34,22.55 | 41.91,8.38 46.18,8.38 46.94,7.62 IC3.2 | 41.91,8.38 38.1,8.38 | v28.8,25.3 28.8,22.71 29.11,22.4 C24.- 29.26,22.25 31.24,22.25 31.7,22.71 35.51,22.71 C10.- | 36.88,21.49 36.73,21.64 C10.- | 36.88,21.49 41.76,16.61 C20.2 41.91,16.46 41.91,8.38 | 44.65,25.3 44.65,24.23 C19.2 | 44.65,25.3 48.46,29.11 JP50.1 48.46,29.26 46.94,30.79 46.94,39.47 48.46,41 48.46,41.91 JP51.1 | v42.67,68.12 48.46,62.33 JP52.1 | 36.88,21.49 40.69,25.3 44.65,25.3 | 36.88,21.49 C10.- | 38.1,8.38 33.53,3.81 29.57,3.81 28.35,5.03 27.58,5.03 JP5.8 | 38.1,8.38 C7.2
  pour Top (isolate 0.012): 0,108.97 50.04,108.97 50.04,0 0,0
  pour Bottom (isolate 0.012): 0,108.97 50.04,108.97 50.04,0 0,0
LED_MODE_G
  Top 0.152: JP24.1 4.27,41.45 10.52,41.45 17.37,48.31 24.99,48.31 26.98,50.29 26.98,50.9 26.82,51.05 26.36,51.05 IC1.35
LED_MODE_R
  Top 0.152: IC1.36 26.21,50.6 18.75,50.6 14.33,46.18 8.84,46.18 8.69,46.33 8.38,46.33 7.77,45.72 7.77,45.11 7.62,44.96 3.35,44.96 1.37,46.94 JP23.1
LED_RANGE_G  (via drill 0.3)
  Top 0.152: v19.66,41 28.04,41 28.19,41.15 28.19,44.81 30.18,46.79 30.18,49.07 IC1.42 | v12.5,48.16 11.58,48.16 11.28,47.85 3.05,47.85 1.37,49.53 JP22.1
  Bottom 0.152: v12.5,48.16 v19.66,41
LED_RANGE_R  (via drill 0.3)
  Top 0.152: v29.26,50.14 29.72,49.68 29.72,49.23 IC1.41 | v25.3,49.99 18.59,49.99 10.36,41.76 7.62,41.76 v5.03,44.35
  Bottom 0.152: v29.26,50.14 25.45,50.14 v25.3,49.99 | v5.03,44.35 5.03,48.31 JP21.1
LED_SHIFT_G
  Top 0.152: IC1.40 29.11,49.07 29.11,48.46 25.45,44.81 23.47,44.81 22.4,43.74 22.4,43.43 22.1,43.13 13.11,43.13 9.45,39.47 1.37,39.47 JP26.1
LED_SHIFT_R  (via drill 0.3)
  Top 0.152: v23.47,46.79 26.98,46.79 28.65,48.46 28.65,49.07 IC1.39 | v18.75,46.79 16.31,46.79 10.67,41.15 2.13,41.15 1.37,41.91 JP25.1
  Bottom 0.152: v18.75,46.79 v23.47,46.79
MUX_ADDR_0  (via drill 0.3)
  Top 0.152: v33.83,58.22 33.22,57.61 IC1.13 | v29.26,95.86 28.65,96.47 28.35,96.47 IC2.11
  Bottom 0.152: v33.83,58.22 33.83,91.29 v29.26,95.86
MUX_ADDR_1  (via drill 0.3)
  Top 0.152: v27.43,93.88 27.43,95.4 27.74,95.71 28.19,95.71 IC2.10 | v32.16,59.74 v30.94,60.96 | v32.77,56.54 32.77,57.45 IC1.14
  Bottom 0.152: v27.43,93.88 30.94,90.37 v30.94,60.96 | v32.16,59.74 32.16,57.15 v32.77,56.54
MUX_ADDR_2  (via drill 0.3)
  Top 0.152: v28.19,92.35 28.19,95.1 IC2.9 | v28.19,60.35 v28.19,62.94 | v31.85,55.93 31.85,56.69 32.16,57 32.16,57.45 IC1.15
  Bottom 0.152: v28.19,62.94 v28.19,92.35 | v28.19,60.35 26.52,58.67 26.52,57.76 28.35,55.93 v31.85,55.93
MUXED_POTS  (via drill 0.3)
  Top 0.152: v33.68,55.63 34.59,55.63 IC1.11 | v26.06,98.3 26.06,98.6 23.16,101.5 21.49,101.5 | 21.49,101.5 21.18,101.5 C56.1 21.49,101.5 | v21.49,98.45 22.55,98.45 IC2.3 | 21.49,101.5 v21.49,100.58
  Bottom 0.152: v33.68,55.63 33.68,57.61 33.07,58.22 33.07,91.29 v26.06,98.3 | v21.49,100.58 v21.49,98.45
N$1
  Bottom 0.152: C19.1 41.91,24.08 42.06,23.93 42.06,20.42 L1.2 42.22,20.27 42.22,18.14 43.43,16.92 43.43,13.72 IC3.1
N$2
  Top 0.152: R62.1 4.12,82.6 1.37,82.6 JP35.1
N$3
  Top 0.152: JP37.1 R63.1
N$4
  Top 0.152: 13.56,88.85 15.54,88.85 R16.1 | IC6.2 22.55,85.19 16.76,85.19 15.7,86.26 R20.1 15.54,86.41 13.56,86.41 | 13.56,86.41 13.56,88.85 | 13.56,88.85 C27.1 | 13.56,86.41 R18.2
N$7
  Top 0.152: IC1.5 34.75,52.58 36.27,52.58 37.64,51.21 37.64,43.13 36.88,42.37 R8.1
N$8
  Top 0.152: IC1.6 34.59,53.03 30.18,53.03 25.15,48.01 23.93,48.01 21.64,45.72 21.64,44.04 R9.1
N$26
  Top 0.152: R61.1 4.12,85.04 1.37,85.04 JP33.1
N$28
  Top 0.152: 35.2,88.85 37.19,88.85 R17.1 | IC6.13 28.35,85.19 33.98,85.19 35.05,86.26 R19.2 35.2,86.41 | 35.2,86.41 37.19,86.41 R21.1 | 35.2,86.41 35.2,88.85 | 35.2,88.85 C28.1
N$29
  Top 0.152: 34.29,44.04 36.73,44.04 R8.2 | 34.29,44.04 33.98,44.35 31.55,44.35 Q1.3 | 34.29,44.04 C4.2
N$30
  Top 0.152: R54.1 37.19,65.99 35.2,65.99 R53.2 35.05,66.14 35.05,66.75 34.14,67.67 | 34.14,67.67 32.92,67.67 32.16,68.43 28.35,68.43 IC7.9 | 34.14,67.67 35.05,68.58 C47.1 R50.1
N$32
  Top 0.152: R52.2 13.56,65.99 15.54,65.99 R55.1 15.7,66.14 15.7,66.75 16.61,67.67 | 16.61,67.67 17.83,67.67 18.59,68.43 22.55,68.43 IC7.6 | 16.61,67.67 15.7,68.58 R51.1 C46.1
N$33
  Bottom 0.152: R5.1 4.12,59.74 1.37,59.74 JP7.2
N$34
  Top 0.152: C31.1 R26.1 15.7,83.82 15.7,83.52 16.76,82.45 | 16.76,82.45 22.55,82.45 IC6.6 | 16.76,82.45 15.7,81.38 R29.1 15.54,81.23 13.56,81.23 R28.2
N$35
  Top 0.152: R9.2 21.64,42.37 24.08,42.37 C11.2 24.23,42.22 24.38,42.06 26.98,42.06 Q1.1
N$37
  Top 0.152: R25.1 C32.1 35.05,83.82 35.05,83.52 33.98,82.45 | 33.98,82.45 28.35,82.45 IC6.9 | 33.98,82.45 35.05,81.38 R27.2 35.2,81.23 37.19,81.23 R30.1
N$38
  Bottom 0.3: D3.A 20.89,14.03 L4.2
N$39
  Top 0.152: C36.1 13.56,73.61 15.54,73.61 R35.1 15.7,73.61 15.7,72.69 16.46,71.93 | 16.46,71.93 18.44,71.93 19.2,71.17 22.55,71.17 IC7.2 | 16.46,71.93 15.7,71.17 R44.1 15.54,71.17 13.56,71.17 R37.2
N$40
  Bottom 0.152: L1.1 44.2,20.27 44.2,16.92 44.5,16.61 C20.1 44.65,16.46 44.65,14.33 48.31,10.67 48.31,4.57 46.94,3.2 25.15,3.2 23.77,4.57 23.77,12.95 | 23.77,12.95 28.96,12.95 29.87,13.87 L2.2 | 23.77,12.95 20.73,12.95 19.36,14.33 16.92,14.33 15.7,13.11 11.89,13.11 L3.2
  Bottom 0.3: D1.C 29.91,14.03 L2.2
N$41
  Top 0.152: R36.1 37.19,73.61 35.2,73.61 C41.1 35.05,73.61 35.05,72.69 34.29,71.93 | 34.29,71.93 32.77,71.93 32,71.17 28.35,71.17 IC7.13 | 34.29,71.93 35.05,71.17 R41.2 35.2,71.17 37.19,71.17 R43.1
N$42
  Bottom 0.152: L3.1 10.36,12.95 10.36,10.21 C25.1 10.36,10.06 10.36,7.16 IC5.3
N$45
  Top 0.152: IC9.14 23.01,24.69 21.34,24.69 20.27,23.62 17.53,23.62 IC9.3 17.37,23.62 15.39,23.62 14.94,24.08 R47.2 14.78,24.23 14.78,26.67 C37.2
N$49  (via drill 0.3)
  Top 0.152: 38.71,24.08 39.78,24.08 R48.1 | 38.71,24.08 37.8,24.08 R39.1 | v38.71,26.52 38.71,24.08
  Bottom 0.152: v38.71,26.52 38.71,37.19 48.46,46.94 JP40.1
N$51
  Bottom 0.152: JP7.1 R4.1
N$53  (via drill 0.3)
  Top 0.152: R47.1 13.11,24.08 11.12,24.08 R42.1 10.97,24.08 10.67,24.08 9.91,23.32 8.69,23.32 8.53,23.47 8.53,24.84 9.45,25.76 9.91,25.76 10.21,26.06 10.21,27.28 20.73,37.8 v26.82,37.8
  Bottom 0.152: v26.82,37.8 41,51.97 48.46,51.97 JP38.1
N$54  (via drill 0.3)
  Top 0.152: v31.09,22.86 29.87,21.64 27.74,21.64 IC8.13 | 35.97,24.99 35.97,24.23 R39.2 | 35.97,24.99 37.64,26.67 R33.1 37.8,26.67 38.25,27.13 38.86,27.13 39.32,26.67 C39.1 | 35.97,24.99 v35.97,25.15
  Bottom 0.152: v31.09,22.86 31.39,22.86 32.77,24.23 35.05,24.23 v35.97,25.15
N$56
  Bottom 0.3: JP5.10 JP5.9 33.02,10.56 D1.A
N$58  (via drill 0.3)
  Top 0.152: R40.1 35.97,21.49 35.97,19.05 R49.1 36.12,19.05 37.34,17.83 42.22,17.83 42.67,18.29 42.67,24.38 41.3,25.76 41,25.76 40.69,26.06 v40.69,34.29
  Bottom 0.152: v40.69,34.29 40.69,36.42 48.62,44.35 JP41.1
N$59
  Top 0.152: 37.8,21.64 36.73,22.71 35.51,22.71 34.9,23.32 34.9,24.99 32.31,27.58 28.19,27.58 28.04,27.43 28.04,26.21 27.58,25.76 27.43,25.76 26.82,25.15 26.82,24.54 27.13,24.23 27.58,24.23 IC8.9 | 37.8,21.64 39.78,21.64 R34.1 39.93,21.49 41.45,19.96 41.45,19.05 C40.1 | 37.8,21.64 R40.2
N$60  (via drill 0.3)
  Top 0.152: v19.51,21.64 23.16,21.64 IC9.9 | v15.85,21.64 14.94,21.64 R32.1 14.78,21.49 14.78,20.73 | 14.78,20.73 14.78,19.05 C38.1 | 14.78,20.73 12.5,20.73 11.73,21.49 11.12,21.49 R38.2
  Bottom 0.152: v15.85,21.64 v19.51,21.64
N$61
  Top 0.152: R42.2 9.45,24.23 9.45,24.84 10.97,26.36 10.97,26.67 R31.1 C37.1 13.26,26.67 13.26,26.98 14.17,27.89 21.03,27.89 21.49,27.43 21.49,26.21 21.95,25.76 23.32,25.76 23.93,25.15 23.93,24.54 23.62,24.23 23.16,24.23 IC9.13
N$63  (via drill 0.3)
  Top 0.152: R38.1 9.3,21.49 9.3,19.05 R45.1 9.45,19.05 10.52,17.98 v10.97,17.98
  Bottom 0.152: v10.97,17.98 10.97,17.53 12.65,15.85 14.63,15.85 16.92,18.14 18.59,18.14 21.79,14.94 21.79,13.56 22.1,13.26 23.01,13.26 27.43,17.68 27.43,37.95 39.01,49.53 JP39.1
N$64
  Bottom 0.3: JP5.2 JP5.1 17.78,9.76 D3.C
N$67  (via drill 0.3)
  Top 0.152: IC9.2 17.37,24.23 16.92,24.23 15.7,25.45 15.7,27.28 15.39,27.58 14.33,27.58 13.87,27.13 13.87,23.47 13.56,23.16 10.21,23.16 10.06,23.01 8.53,23.01 2.44,29.11 2.44,33.22 1.37,34.29 JP43.1 | v4.12,25.6 4.12,21.64 R64.1
  Bottom 0.152: v4.12,25.6 4.12,31.55 1.37,34.29 JP43.1
N$68  (via drill 0.3)
  Top 0.152: v16.31,25.91 17.37,24.84 IC9.1 | v8.38,33.83 4.27,33.83 JP42.1
  Bottom 0.152: v8.38,33.83 v16.31,25.91
N$70  (via drill 0.3)
  Top 0.152: v16.46,22.25 17.37,22.25 IC9.5 | v13.41,20.12 13.41,19.2 13.26,19.05 C38.2 R45.2 | v18.9,22.25 18.9,21.49 19.36,21.03 23.16,21.03 IC9.8
  Bottom 0.152: v13.41,20.12 15.54,22.25 v16.46,22.25 v18.9,22.25
N$71  (via drill 0.3)
  Top 0.152: v15.85,19.51 15.85,20.42 16.92,21.49 17.37,21.49 IC9.6 | v12.8,16.46 6.86,16.46 4.27,19.05 R65.1 4.12,19.05 v3.2,19.96
  Bottom 0.152: v12.8,16.46 v15.85,19.51 | v3.2,19.96 3.2,28.96 1.37,30.79 1.37,31.7 JP45.1
N$72
  Top 0.152: JP44.1 6.71,23.77 6.71,20.27 9.6,17.37 14.63,17.37 17.37,20.12 17.37,20.88 IC9.7
N$73  (via drill 0.3)
  Top 0.152: v30.48,21.03 27.74,21.03 IC8.14 | IC8.3 33.38,22.1 v34.29,22.1 34.75,21.64 34.75,18.9 36.12,17.53 42.37,17.53 42.98,18.14 42.98,24.54 41.6,25.91 41.6,26.67 C39.2 | v38.71,18.44 39.01,18.14 42.06,18.14 42.37,18.44 42.37,22.1 41.6,22.86 41.6,24.08 R48.2
  Bottom 0.152: v30.48,21.03 31.55,22.1 33.98,22.1 | v34.29,22.1 33.98,22.1 | v38.71,18.44 37.03,20.12 35.97,20.12 33.98,22.1
N$74
  Top 0.152: IC8.2 33.38,21.49 33.83,21.49 34.44,20.88 34.44,18.75 35.97,17.22 42.52,17.22 43.89,18.59 43.89,21.49 R66.1 44.04,21.64 44.81,22.4 44.81,29.72 48.46,33.38 48.46,34.29 JP47.1
N$75  (via drill 0.3)
  Top 0.152: v28.04,18.44 28.35,18.14 33.07,18.14 33.38,18.44 33.38,20.88 IC8.1 | v31.09,30.48 36.12,30.48 43.59,37.95 v47.55,37.95
  Bottom 0.152: v28.04,18.44 28.04,27.43 v31.09,30.48 | v47.55,37.95 47.55,37.64 47.24,37.34 47.24,33.07 48.46,31.85 JP46.1
N$76
  Top 0.152: C40.2 R49.2 37.64,19.05 37.64,20.12 36.73,21.03 36.73,22.25 36.58,22.4 34.9,22.4 33.83,23.47 33.38,23.47 IC8.5 33.22,23.62 32.77,23.62 31.7,24.69 27.74,24.69 IC8.8
N$77  (via drill 0.3)
  Top 0.152: v34.29,24.84 34.29,24.69 33.83,24.23 33.38,24.23 IC8.6 | R67.1 43.89,24.23 42.52,25.6 v42.52,25.91 42.52,30.02 48.46,35.97 48.46,36.73 JP49.1
  Bottom 0.152: v34.29,24.84 34.9,24.84 35.97,25.91 v42.52,25.91
N$78  (via drill 0.3)
  Top 0.152: v33.38,25.76 33.38,24.84 IC8.7 | v38.1,34.44 39.62,34.44 44.5,39.32 48.46,39.32 JP48.1
  Bottom 0.152: v33.38,25.76 33.38,29.72 v38.1,34.44
NORMALIZATION_PROBE  (via drill 0.3)
  Top 0.152: 5.94,80.01 5.94,82.45 R62.2 5.94,82.6 5.94,85.04 R61.2 | v21.03,57 24.38,53.65 26.21,53.65 IC1.30 | v18.59,60.05 17.68,60.96 D2.3 13.26,60.96 5.94,68.28 5.94,80.01 | 5.94,80.01 R63.2
  Bottom 0.152: v21.03,57 21.03,57.61 v18.59,60.05
RESET  (via drill 0.3)
  Top 0.152: IC1.7 34.75,53.49 37.8,53.49 39.32,51.97 C2.1 39.47,51.97 40.84,51.97 v44.2,55.32
  Bottom 0.152: JP6.4 1.37,72.39 3.81,74.83 4.12,74.83 R3.2 4.27,74.83 12.65,66.45 17.37,66.45 19.05,68.12 19.05,78.79 23.01,82.75 23.01,103.78 24.08,104.85 27.89,104.85 28.35,104.39 28.35,100.58 34.14,94.79 34.14,75.89 44.2,65.84 v44.2,55.32
RX  (via drill 0.3)
  Top 0.152: v32.31,47.55 32.31,49.07 IC1.46 | v25.3,40.39 10.82,40.39 9.3,38.86 v6.55,38.86
  Bottom 0.152: v32.31,47.55 25.3,40.54 v25.3,40.39 | v6.55,38.86 6.55,56.54 5.94,57.15 R4.2
SHAPE_ATT
  Top 0.152: JP13.1 6.25,97.69 22.55,97.69 IC2.4
SHAPE_IN  (via drill 0.3)
  Top 0.152: R30.2 39.01,81.38 39.01,81.99 43.13,86.11 43.13,90.83 43.89,91.59 46.02,91.59 46.48,92.05 46.48,93.42 45.41,94.49 44.96,94.49 44.81,94.64 44.81,95.86 45.11,96.16 46.94,96.16 48.46,97.69 JP27.1 | v46.63,98.75 45.72,97.84 D4.2
  Bottom 0.152: v46.63,98.75 47.55,98.75 48.46,97.84 JP27.1
SHAPE_POT  (via drill 0.3)
  Top 0.152: v47.24,66.14 36.27,55.17 34.75,55.17 IC1.10
  Bottom 0.152: v47.24,66.14 47.24,68.58 48.46,69.8 JP17.1
SHIFT_ATT
  Top 0.152: JP15.1 26.21,102.87 28.96,100.13 28.96,99.36 28.8,99.21 28.35,99.21 IC2.15
SHIFT_IN  (via drill 0.3)
  Top 0.152: v39.01,91.14 39.01,89 R17.2 | v42.67,95.1 v40.54,92.96 | JP30.1 D5.2
  Bottom 0.152: v39.01,91.14 39.01,91.44 v40.54,92.96 | v42.67,95.1 48.31,95.1 48.46,95.25 JP30.1
SHIFT_POT
  Top 0.152: JP14.1 3.35,102.41 22.71,102.41 26.67,98.45 28.19,98.45 IC2.14
SLOPE_ATT
  Top 0.152: IC2.1 22.55,99.67 3.2,99.67 1.37,97.84 JP10.1
SLOPE_IN  (via drill 0.3)
  Top 0.152: v17.37,90.07 17.37,89 R16.2 | v19.51,103.48 28.96,103.48 34.44,97.99 38.1,97.99 v38.71,97.38 | v46.33,88.85 45.72,88.24 45.72,87.63 D8.2
  Bottom 0.152: v17.37,90.07 17.37,101.35 v19.51,103.48 | 46.79,89.31 48.46,87.63 JP31.1 | 46.79,89.31 v38.71,97.38 | 46.79,89.31 v46.33,88.85
SLOPE_POT
  Top 0.152: IC2.12 28.35,97.08 37.8,97.08 38.41,96.47 45.87,96.47 47.24,97.84 47.24,99.06 48.46,100.28 JP8.1
SMOOTHNESS_ATT
  Top 0.152: IC2.5 22.55,97.08 8.23,97.08 1.37,90.22 JP12.1
SMOOTHNESS_IN
  Top 0.152: 38.86,79.7 38.86,79.86 38.1,80.62 38.1,87.02 39.17,88.09 39.93,88.09 43.74,91.9 44.81,91.9 45.57,92.66 D6.2 | 38.86,79.7 38.86,73.76 R36.2 | 38.86,79.7 42.52,83.36 45.41,83.36 46.94,84.89 46.94,90.37 48.46,91.9 48.46,92.66 JP28.1
SMOOTHNESS_POT
  Top 0.152: JP9.1 47.55,102.87 41.45,96.77 38.56,96.77 37.64,97.69 28.35,97.69 IC2.13
SW_MODE  (via drill 0.3)
  Top 0.152: v24.08,52.43 24.38,52.12 26.21,52.12 IC1.33 | v24.08,55.47 20.42,59.13 14.02,59.13 5.03,68.12 5.03,85.8 3.2,87.63 JP61.1
  Bottom 0.152: v24.08,55.47 v24.08,52.43
SW_RANGE
  Top 0.152: IC1.12 34.75,56.08 36.42,56.08 47.55,67.21 48.46,67.21 JP60.1
SW_SHIFT  (via drill 0.3)
  Top 0.152: v36.12,51.97 35.36,51.21 34.75,51.21 IC1.2 | v40.84,57.3 48.31,64.77 JP62.1
  Bottom 0.152: v36.12,51.97 36.12,52.58 v40.84,57.3
SWCLK  (via drill 0.3)
  Top 0.152: v24.08,47.4 24.99,47.4 26.67,49.07 27.74,49.07 IC1.37 | v14.33,53.19 14.33,58.22 2.74,69.8 1.37,69.8 JP6.3
  Bottom 0.152: v24.08,47.4 20.88,47.4 15.09,53.19 v14.33,53.19
SWDIO
  Top 0.152: IC1.34 26.21,51.51 19.2,51.51 17.37,49.68 16.92,49.68 12.65,53.95 12.65,59.44 4.88,67.21 1.37,67.21 JP6.2
TRIG_IN  (via drill 0.3)
  Top 0.152: v16.61,80.31 17.22,80.92 17.22,81.23 R29.2 | v49.38,89 48.16,89 47.24,88.09 47.24,83.82 | 47.24,83.82 48.46,82.6 JP34.1 | 47.24,83.82 46.02,82.6 45.72,82.6 D10.2
  Bottom 0.152: v16.61,80.31 16.61,89.61 16.46,89.76 16.46,102.26 21.03,106.83 30.02,106.83 41.76,95.1 41.76,94.79 47.55,89 v49.38,89
TX  (via drill 0.3)
  Top 0.152: v31.7,46.02 31.7,49.07 IC1.45 | v25.3,39.62 10.52,39.62 9.14,38.25 6.4,38.25 v5.79,38.86
  Bottom 0.152: v25.3,39.62 v31.7,46.02 | v5.79,38.86 5.79,55.78 5.18,56.39 5.18,58.98 5.79,59.59 R5.2
V_OCT_IN  (via drill 0.3)
  Top 0.152: v42.67,82.75 42.67,70.87 39.01,67.21 39.01,66.14 R54.2 | v44.65,88.85 44.65,89.15 45.57,90.07 D7.2 45.72,90.07 v46.63,90.98
  Bottom 0.152: v42.67,82.75 42.67,86.87 v44.65,88.85 | v46.63,90.98 47.4,90.22 48.46,90.22 JP29.1
VCC  (via drill 0.3)
  Top 0.3: 32.33,20.42 32.33,22.53 32.51,22.71 33.22,22.71 IC8.4 | C49.1 32.46,19.05 32.46,20.42 32.33,20.42 | IC9.4 18.09,22.86 18.29,22.66 18.29,20.42 | 18.29,20.42 18.29,19.05 C48.1 | 18.29,20.42 v29.26,20.42 32.33,20.42
  Bottom 0.3: L2.1 28.35,14.02 28.35,17.37 29.11,18.14 C24.+ 29.26,18.29 v29.26,20.42
VEE  (via drill 0.3)
  Top 0.3: 25.45,22.86 27.58,22.86 IC8.11 | 25.45,22.86 v24.69,22.86 IC9.11 | C33.2 25.45,26.67 | 25.45,26.67 C34.2 | 25.45,26.67 25.45,22.86
  Bottom 0.3: L4.1 22.4,14.02 22.4,17.37 21.64,18.14 C26.- 21.64,18.29 24.69,21.34 v24.69,22.86 24.69,103.94 R46.1
VREF
  Top 0.152: 9.3,54.25 11.12,54.25 IC4.3 | 9.3,54.25 6.4,54.25 C18.1 | 9.3,54.25 9.3,55.93 10.97,57.61 10.97,59.59 R14.2
VREF_BIAS  (via drill 0.3)
  Top 0.152: 7.16,57.15 7.16,59.59 R15.2 7.32,59.74 9.3,59.74 R14.1 | 23.16,22.25 22.71,22.25 22.4,22.55 22.4,23.01 | 22.4,23.01 22.4,23.16 22.71,23.47 23.16,23.47 IC9.12 | IC8.10 27.74,23.47 28.04,23.47 28.5,23.01 28.5,22.71 28.04,22.25 27.74,22.25 IC8.12 27.58,22.25 23.16,22.25 | 23.16,22.25 IC9.10 | v7.16,55.17 7.16,57.15 | v7.92,43.59 v7.16,44.35 | 22.4,23.01 v20.27,23.01 | 7.16,57.15 C21.1
  Bottom 0.152: v7.16,44.35 v7.16,55.17 | v7.92,43.59 7.92,42.98 20.27,30.63 v20.27,23.01

## Text on the board
tNames: SHIFT_ATT | SMOOTHNESS_POT | SHIFT_POT | SLOPE_POT | SLOPE_ATT | J5 | FREQUENCY_ATT | J6 | SHAPE_ATT | J4 | SMOOTHNESS_ATT | J3 | SW_3_SW_MODE | J1 | J2_TIP_2 | J2_TIP_1 | J7_TIP_2 | J7_TIP_1 | J8_TIP_2 | J8_TIP_1 | FREQUENCY_POT | SHAPE_POT | SW_2_SW_RANGE | SW_1_SW_SHIFT | GND | LED_1_R | J9 | LED_1_G | J10 | LED_3_R | J11 | LED_3_G | J12 | LED_2_R | GND | LED_2_G | LED7_1 | LED4_1 | LED7_2 | LED4_2 | LED6_2 | LED5_2 | LED6_1 | LED5_1 | GND
bNames: 2019-v1.2 | mod by: | µMotion-2 | RESET | SWCLK | SWDIO | Original design by Émilie Gillet | GND | TX | CC-BY-SA-3.0 | RX | SN
_tNames: SMOOTHNESS_POT | SHIFT_ATT | SHIFT_POT | SLOPE_POT | SLOPE_ATT | J5 | FREQUENCY_ATT | J6 | SHAPE_ATT | J4 | SMOOTHNESS_ATT | J3 | SW_3_SW_MODE | J1 | J2_TIP_2 | J2_TIP_1 | J7_TIP_2 | J7_TIP_1 | J8_TIP_2 | J8_TIP_1 | FREQUENCY_POT | SHAPE_POT | SW_2_SW_RANGE | SW_1_SW_SHIFT | GND | LED_1_R | J9 | LED_1_G | J10 | LED_3_R | J11 | LED_3_G | J12 | LED_2_R | GND | LED_2_G | LED7_1 | LED4_1 | LED7_2 | LED4_2 | LED6_2 | LED5_2 | LED6_1 | LED5_1 | GND